# Altium schematic sheet KeyInput_IJMEF.SchDoc
size A4
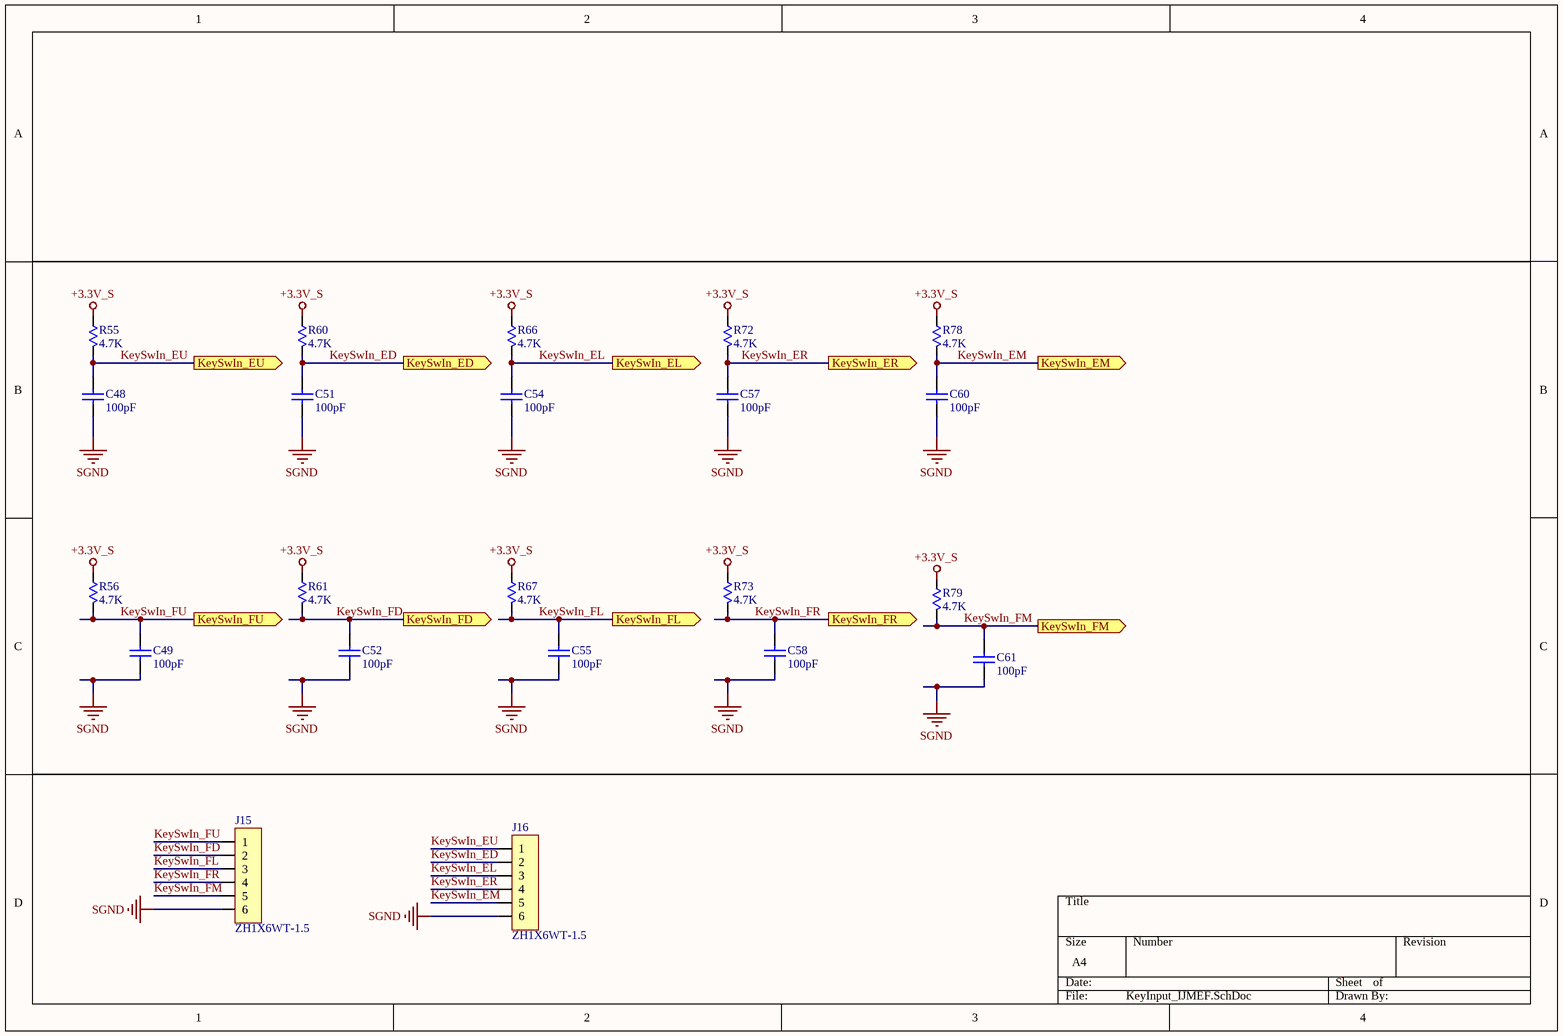
[diagram p0: KeyInput_IJMEF.SchDoc]

## Parts
C48  100pF  [C0805]
C49  100pF  [C0805]
C51  100pF  [C0805]
C52  100pF  [C0805]
C54  100pF  [C0805]
C55  100pF  [C0805]
C57  100pF  [C0805]
C58  100pF  [C0805]
C60  100pF  [C0805]
C61  100pF  [C0805]
J15  ZH1X6WT-1.5  [ZH1X6WT-1.5]
J16  ZH1X6WT-1.5  [ZH1X6WT-1.5]
R55  4.7K  [R0805]
R56  4.7K  [R0805]
R60  4.7K  [R0805]
R61  4.7K  [R0805]
R66  4.7K  [R0805]
R67  4.7K  [R0805]
R72  4.7K  [R0805]
R73  4.7K  [R0805]
R78  4.7K  [R0805]
R79  4.7K  [R0805]

## Ports
KeySwIn_ED (out), KeySwIn_EL (out), KeySwIn_EM (out), KeySwIn_ER (out), KeySwIn_EU (out), KeySwIn_FD (out), KeySwIn_FL (out), KeySwIn_FM (out), KeySwIn_FR (out), KeySwIn_FU (out)

## Nets
+3.3V_S: R55.2 R56.2 R60.2 R61.2 R66.2 R67.2 R72.2 R73.2 R78.2 R79.2
SGND: C48.2 C49.2 C51.2 C52.2 C54.2 C55.2 C57.2 C58.2 C60.2 C61.2 J15.6 J16.6
KeySwIn_ED: C51.1 J16.2 R60.1 ; port KeySwIn_ED
KeySwIn_EL: C54.1 J16.3 R66.1 ; port KeySwIn_EL
KeySwIn_EM: C60.1 J16.5 R78.1 ; port KeySwIn_EM
KeySwIn_ER: C57.1 J16.4 R72.1 ; port KeySwIn_ER
KeySwIn_EU: C48.1 J16.1 R55.1 ; port KeySwIn_EU
KeySwIn_FD: C52.1 J15.2 R61.1 ; port KeySwIn_FD
KeySwIn_FL: C55.1 J15.3 R67.1 ; port KeySwIn_FL
KeySwIn_FM: C61.1 J15.5 R79.1 ; port KeySwIn_FM
KeySwIn_FR: C58.1 J15.4 R73.1 ; port KeySwIn_FR
KeySwIn_FU: C49.1 J15.1 R56.1 ; port KeySwIn_FU

## Library data of the parts
C48 C49 C51 C52 C54 C55 C57 C58 C60 C61 = Cap: Capacitor; Value: 22pF; Published: 8-Jun-2000; Revision: July-2002: Re-released for DXP Platform.; Publisher: Altium Limited
J15 J16 = HEADER1X6
R55 R56 R60 R61 R66 R67 R72 R73 R78 R79 = RES: Resistor; Published: 8-Jun-2000; LatestRevisionDate: 17-Jul-2002; LatestRevisionNote: Re-released for DXP Platform.; PackageReference: AXIAL-0.3; Publisher: Altium Limited; Value: 4.7K